# EAGLE design 28_TSSOP_bob(1) (EAGLE 8.2.1)
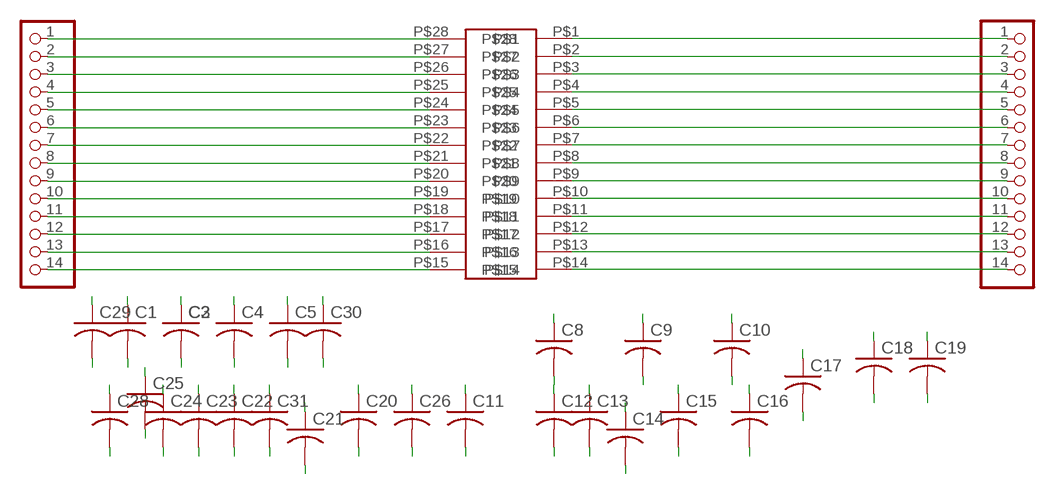
[diagram p0: schematic, sheet 1]

## Parts
C1  C-USC0805  [C0805]
C2  C-USC0805  [C0805]
C3  C-USC0805  [C0805]
C4  C-USC0805  [C0805]
C5  C-USC0805  [C0805]
C8  C-USC0805  [C0805]
C9  C-USC0805  [C0805]
C10  C-USC0805  [C0805]
C11  C-USC0805  [C0805]
C12  C-USC0805  [C0805]
C13  C-USC0805  [C0805]
C14  C-USC0805  [C0805]
C15  C-USC0805  [C0805]
C16  C-USC0805  [C0805]
C17  C-USC0805  [C0805]
C18  C-USC0805  [C0805]
C19  C-USC0805  [C0805]
C20  C-USC0805  [C0805]
C21  C-USC0805  [C0805]
C22  C-USC0805  [C0805]
C23  C-USC0805  [C0805]
C24  C-USC0805  [C0805]
C25  C-USC0805  [C0805]
C26  C-USC0805  [C0805]
C28  C-USC0805  [C0805]
C29  C-USC0805  [C0805]
C30  C-USC0805  [C0805]
C31  C-USC0805  [C0805]
JP1  PADS-14  [PADS-14]
JP2  PADS-14  [PADS-14]
U$2  28-PINTSSOP-NW  [TSSOP28-NW]

## Nets
1220: C29.2
N$13: C1.2
N$15: C1.1 JP2.1 U$2.P$1
N$30: C2.1 JP1.1 U$2.P$28
N$31: C2.2
N$32: C3.1 JP1.2 U$2.P$27
N$33: C3.2
N$34: C4.1 JP1.5 U$2.P$24
N$35: C4.2
N$36: C5.1
N$37: C5.2 JP2.6 U$2.P$6
N$42: C8.1 JP1.8 U$2.P$21
N$43: C8.2
N$44: C9.1
N$45: C9.2 JP2.8 U$2.P$8
N$46: C10.1
N$47: C10.2 JP2.4 U$2.P$4
N$48: C11.1 JP1.9 U$2.P$20
N$49: C11.2
N$50: C12.1 JP1.4 U$2.P$25
N$51: C12.2
N$52: C13.1
N$53: C13.2 JP2.2 U$2.P$2
N$54: C14.1 JP1.3 U$2.P$26
N$55: C14.2
N$56: C15.1
N$57: C15.2 JP2.5 U$2.P$5
N$58: C16.1 JP1.7 U$2.P$22
N$59: C16.2
N$60: C17.1
N$61: C17.2 JP2.3 U$2.P$3
N$62: C18.1
N$63: C18.2 JP2.9 U$2.P$9
N$64: C19.1 JP1.6 U$2.P$23
N$65: C19.2
N$66: C20.1
N$67: C20.2 JP2.7 U$2.P$7
N$68: C21.1 JP1.14 U$2.P$15
N$69: C21.2
N$70: C22.1 JP1.13 U$2.P$16
N$71: C22.2
N$72: C23.1
N$73: C23.2 JP2.14 U$2.P$14
N$74: C24.1 JP1.10 U$2.P$19
N$75: C24.2
N$76: C25.1
N$77: C25.2 JP2.11 U$2.P$11
N$78: C26.1 JP1.12 U$2.P$17
N$79: C26.2
N$82: C28.1 JP1.11 U$2.P$18
N$83: C28.2
N$86: C30.1
N$87: C30.2 JP2.13 U$2.P$13
N$88: C31.1 JP2.10 U$2.P$10
N$89: C31.2
N$1000: C29.1 JP2.12 U$2.P$12

## Library data of the parts
C1-C5 C8-C26 C28-C31 = rcl:C-US: CAPACITOR, American symbol
JP1 JP2 = breakouts:PADS-14: PIN HEADER
U$2 = breakouts:28-PIN

## Board
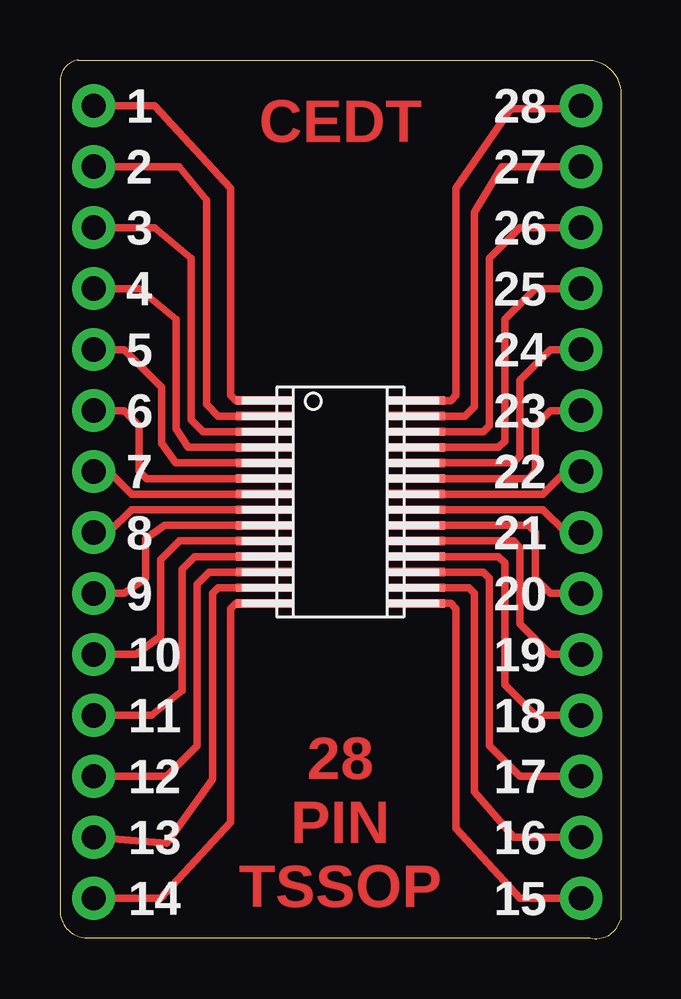
[diagram p1: board, top side]
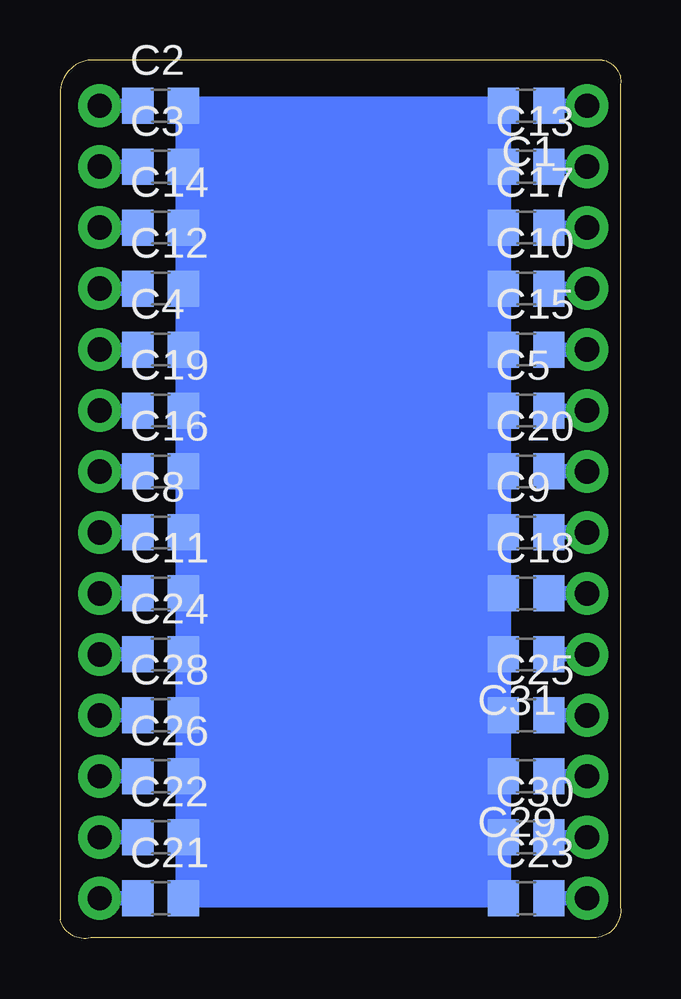
[diagram p2: board, bottom side, seen from below]

Size 23.38 x 36.61 mm. Coordinates in mm from the lower left corner, seen from the top.
Outline: 0.77,36.61 arc90 0.01,35.59 0.01,1.3 arc90 1.02,0.03 22.11,0.03 arc90 23.38,0.79 23.38,35.08 arc90 22.11,36.61 0.77,36.61
Copper layers (1*16): Top 0.035mm / dielectric 1.5mm / Bottom 0.035mm
Design rules "default *": minimum track width 10mil, minimum drill 16mil, track to track 10mil, track to pad 10mil, pad to pad 10mil, via to via 10mil, smd to smd 10mil, copper to edge 10mil, drill to drill 8mil, minimum pad ring 10mil, minimum via ring 8mil, stop-mask expansion 4mil, vias tented up to drill 20mil, thermal gap 10mil

### Footprints (pad centres in the part's own frame; a part is rotated, then mirrored left to right if it is on the bottom)
C0805 = smd 1.3 x 1.5: 1 -0.95,0; 2 0.95,0
PADS-14 = drill 1.016 pad 1.778: 1 -16.51,0; 2 -13.97,0; 3 -11.43,0; 4 -8.89,0; 5 -6.35,0; 6 -3.81,0; 7 -1.27,0; 8 1.27,0; 9 3.81,0; 10 6.35,0; 11 8.89,0; 12 11.43,0; 13 13.97,0; 14 16.51,0
TSSOP28-NW = smd 2.4 x 0.35: P$1 -3.15,4.225; P$2 -3.15,3.575; P$3 -3.15,2.925; P$4 -3.15,2.275; P$5 -3.15,1.625; P$6 -3.15,0.975; P$7 -3.15,0.325; P$8 -3.15,-0.325; P$9 -3.15,-0.975; P$10 -3.15,-1.625; P$11 -3.15,-2.275; P$12 -3.15,-2.925; P$13 -3.15,-3.575; P$14 -3.15,-4.225; P$15 3.15,-4.225; P$16 3.15,-3.575; P$17 3.15,-2.925; P$18 3.15,-2.275; P$19 3.15,-1.625; P$20 3.15,-0.975; P$21 3.15,-0.325; P$22 3.15,0.325; P$23 3.15,0.975; P$24 3.15,1.625; P$25 3.15,2.275; P$26 3.15,2.925; P$27 3.15,3.575; P$28 3.15,4.225

### Placement (x,y rotation side)
C1  3.95,34.7 180 bottom
C2  19.19,34.7 0 bottom
C3  19.19,32.16 0 bottom
C4  19.19,24.54 0 bottom
C5  3.95,22 0 bottom
C8  19.19,16.92 0 bottom
C9  3.95,16.92 0 bottom
C10  3.95,27.08 0 bottom
C11  19.19,14.38 0 bottom
C12  19.19,27.08 0 bottom
C13  3.95,32.16 0 bottom
C14  19.19,29.62 0 bottom
C15  3.95,24.54 0 bottom
C16  19.19,19.46 0 bottom
C17  3.95,29.62 0 bottom
C18  3.95,14.38 0 bottom
C19  19.19,22 0 bottom
C20  3.95,19.46 0 bottom
C21  19.19,1.68 0 bottom
C22  19.19,4.22 0 bottom
C23  3.95,1.68 0 bottom
C24  19.19,11.84 0 bottom
C25  3.95,9.3 0 bottom
C26  19.19,6.76 0 bottom
C28  19.19,9.3 0 bottom
C29  3.95,6.76 180 bottom
C30  3.95,4.22 0 bottom
C31  3.95,11.84 180 bottom
JP1  21.73,18.19 270 top
JP2  1.41,18.19 270 top
U$2  11.69,18.19 0 top

### Tracks (layer width: path | path; a pad name or v marks a point on that pad's centre or on a via)
N$15
  Top 0.305: JP2.1 3.95,34.7 7.12,31.27 7.12,22.64 7.34,22.42 U$2.P$1
  Bottom 0.61: C1.1 JP2.1
N$30
  Top 0.305: U$2.P$28 16.3,22.42 16.52,22.64 16.52,31.27 18.8,34.57 21.6,34.57 JP1.1
  Bottom 0.61: C2.1 JP1.1
N$32
  Top 0.305: U$2.P$27 16.88,21.77 17.28,22.17 17.28,30.26 18.42,32.16 JP1.2
  Bottom 0.61: JP1.2 C3.1
N$34
  Top 0.305: U$2.P$24 18.91,19.82 19.19,20.1 19.19,23.27 20.46,24.54 JP1.5
  Bottom 0.61: C4.1 JP1.5
N$37
  Top 0.305: U$2.P$6 3.61,19.17 3.31,19.46 3.31,21.37 2.68,22 JP2.6
  Bottom 0.61: JP2.6 C5.2
N$42
  Top 0.305: U$2.P$21 20.15,17.87 21.09,16.92 JP1.8
  Bottom 0.61: JP1.8 C8.1
N$45
  Top 0.305: U$2.P$8 2.99,17.87 2.04,16.92 JP2.8
  Bottom 0.61: JP2.8 C9.2
N$47
  Top 0.305: U$2.P$4 5.35,20.47 4.83,21.24 4.83,25.81 3.31,27.08 JP2.4
  Bottom 0.61: JP2.4 C10.2
N$48
  Top 0.305: U$2.P$20 19.53,17.22 19.82,16.92 19.82,15.02 20.46,14.38 JP1.9
  Bottom 0.61: C11.1 JP1.9
N$50
  Top 0.305: U$2.P$25 18.29,20.47 18.55,20.73 18.55,25.81 19.82,27.08 JP1.4
  Bottom 0.61: JP1.4 C12.1
N$53
  Top 0.305: U$2.P$2 6.59,21.77 6.1,22.26 6.1,30.76 4.96,32.16 JP2.2
  Bottom 0.61: JP2.2 C13.2
N$54
  Top 0.305: U$2.P$26 17.67,21.12 17.92,21.37 17.92,28.35 19.19,29.62 JP1.3
  Bottom 0.61: C14.1 JP1.3
N$57
  Top 0.305: U$2.P$5 4.82,19.82 4.24,20.65 4.24,22.98 2.68,24.54 JP2.5
  Bottom 0.61: C15.2 JP2.5
N$58
  Top 0.305: U$2.P$22 20.15,18.52 21.09,19.46 JP1.7
  Bottom 0.61: C16.1 JP1.7
N$61
  Top 0.305: U$2.P$3 5.97,21.12 5.47,21.62 5.47,28.35 3.95,29.62 JP2.3
  Bottom 0.61: C17.2 JP2.3
N$63
  Top 0.305: U$2.P$9 4.37,17.22 3.56,16.67 3.56,15.02 2.68,14.38 JP2.9
  Bottom 0.61: C18.2 JP2.9
N$64
  Top 0.305: U$2.P$23 19.53,19.17 19.82,19.46 19.82,21.37 20.46,22 JP1.6
  Bottom 0.61: JP1.6 C19.1
N$67
  Top 0.305: U$2.P$7 2.99,18.52 2.04,19.46 JP2.7
  Bottom 0.61: C20.2 JP2.7
N$68
  Top 0.305: U$2.P$15 16.3,13.97 16.52,13.75 16.52,4.6 19.19,1.68 JP1.14
  Bottom 0.61: C21.1 JP1.14
N$70
  Top 0.305: U$2.P$16 17.05,14.62 17.28,14.38 17.28,6.13 18.93,4.22 JP1.13
  Bottom 0.61: JP1.13 C22.1
N$73
  Top 0.305: JP2.14 4.2,1.68 7.12,4.86 7.12,13.75 7.34,13.97 U$2.P$14
  Bottom 0.61: JP2.14 C23.2
N$74
  Top 0.305: U$2.P$19 18.91,16.57 19.19,16.29 19.19,13.11 20.46,11.84 JP1.10
  Bottom 0.61: JP1.10 C24.1
N$77
  Top 0.305: U$2.P$11 5.61,15.92 5.09,15.4 5.09,10.32 3.82,9.3 JP2.11
  Bottom 0.61: C25.2 JP2.11
N$78
  Top 0.305: U$2.P$17 17.67,15.27 17.92,15.02 17.92,8.03 19.19,6.76 JP1.12
  Bottom 0.61: C26.1 JP1.12
N$82
  Top 0.305: U$2.P$18 18.29,15.92 18.55,15.65 18.55,10.57 19.82,9.3 JP1.11
  Bottom 0.61: C28.1 JP1.11
N$87
  Top 0.305: U$2.P$13 6.59,14.62 6.36,14.38 6.36,6.63 4.45,3.97 JP2.13
  Bottom 0.305: 2.55,4.22 C30.2
  Bottom 0.61: JP2.13 2.55,4.22
N$88
  Top 0.305: U$2.P$10 4.99,16.57 4.2,15.78 4.2,12.6 3.18,11.84 JP2.10
  Bottom 0.61: JP2.10 C31.1
N$1000
  Top 0.305: JP2.12 4.45,6.76 5.72,8.03 5.72,14.76 6.23,15.27 U$2.P$12
  Bottom 0.61: JP2.12 C29.1
(copper drawn outside any net)
  shapes: Bottom area x1

### Text on the board
Top: CEDT | 28 / PIN / TSSOP
tPlace: 1 | 28 | 2 | 27 | 3 | 26 | 4 | 25 | 5 | 24 | 6 | 23 | 7 | 22 | 8 | 21 | 9 | 20 | 10 | 19 | 11 | 18 | 12 | 17 | 13 | 16 | 14 | 15
tStop: CEDT | 28 / PIN / TSSOP